# Altium project STM32F411.PrjPcb
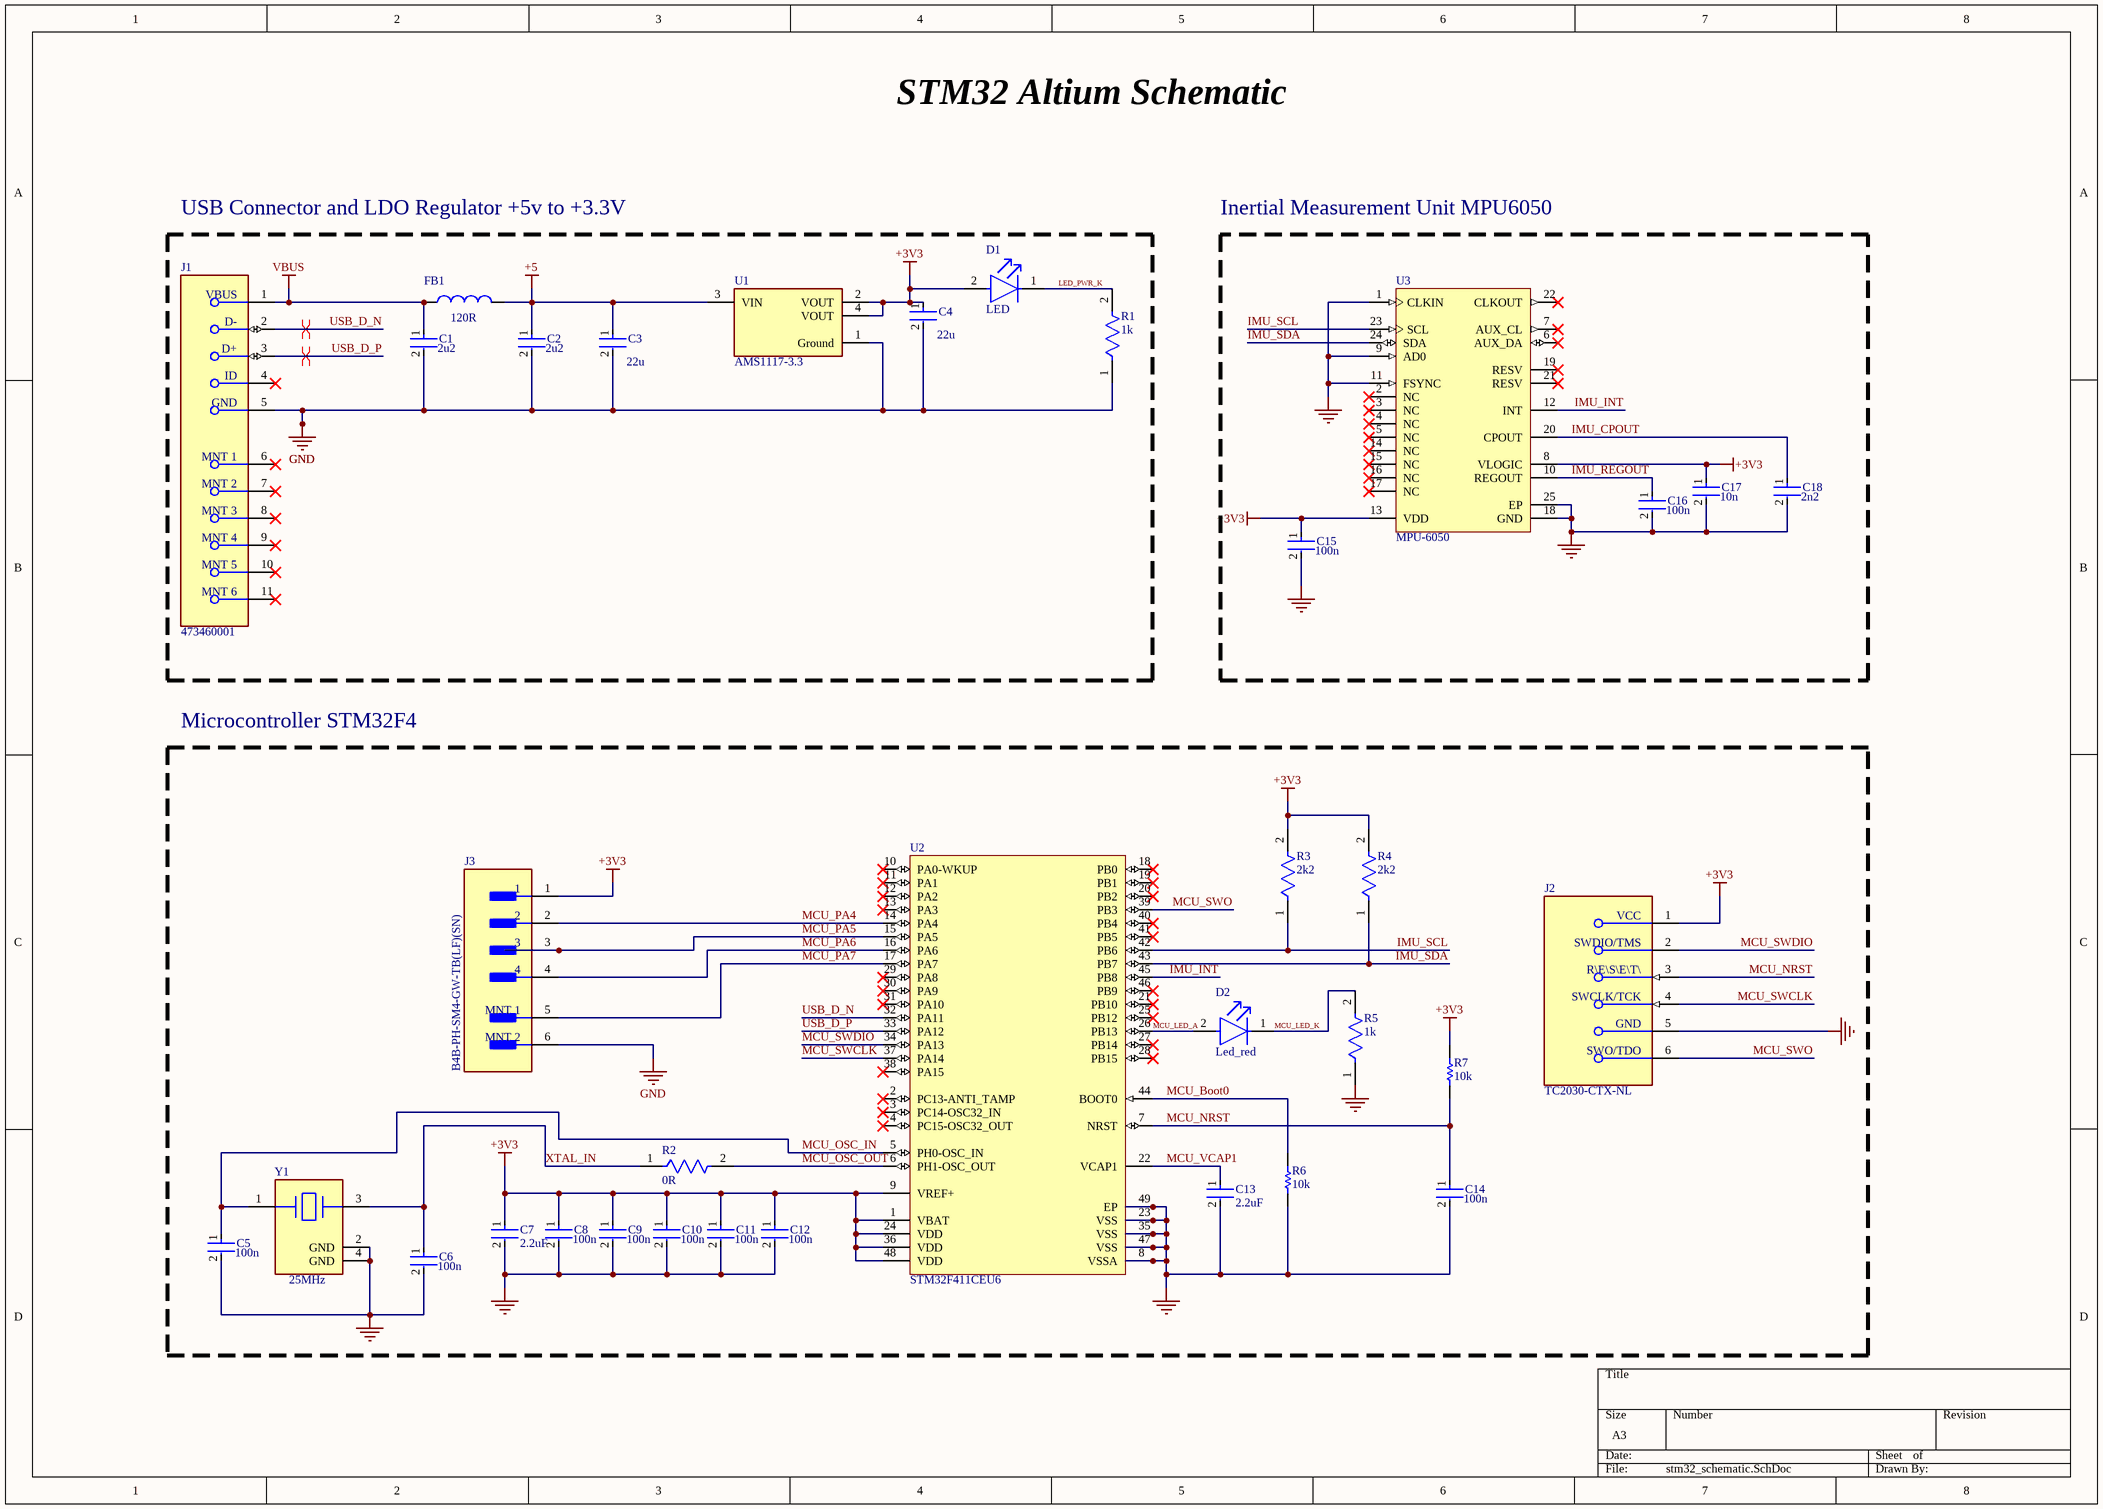
[diagram p0: stm32_schematic.SchDoc]
1 sheet, 35 parts. Net scope: global (net labels, ports and power ports of the same name join across sheets).
Board file: stm32PCB1.PcbDoc

## Sheet stm32_schematic.SchDoc
size A3; SheetNumber: 1; SheetTotal: 1

### Parts
C1  2u2  [FP-CC0402-MFG]
C2  2u2  [FP-CC0402-MFG]
C3  22u  [FP-GRM21B-0_15-IPC_A]
C4  22u  [FP-GRM21B-0_15-IPC_A]
C5  100n  [FP-CC0402-MFG]
C6  100n  [FP-CC0402-MFG]
C7  2.2uF  [FP-C0603C-CF-MFG]
C8  100n  [FP-CC0402-MFG]
C9  100n  [FP-CC0402-MFG]
C10  100n  [FP-CC0402-MFG]
C11  100n  [FP-CC0402-MFG]
C12  100n  [FP-CC0402-MFG]
C13  2.2uF  [FP-C0603C-CF-MFG]
C14  100n  [FP-CC0402-MFG]
C15  100n  [FP-CC0402-MFG]
C16  100n  [FP-CC0402-MFG]
C17  10n  [FP-CC0402-MFG]
C18  2n2  [FP-CC0402-MFG]
D1  LED  [FP-APHHS1005CGCK-MFG]
D2  Led_red  [FP-5988A10107F-MFG]
FB1  120R  [WE-CBA_0805_L2W1.2H0.9_HC]
J1  473460001  [FP-473460001-MFG]
J2  TC2030-CTX-NL  [FP-TC2030-CTX-NL-MFG]
J3  B4B-PH-SM4-GW-TB(LF)(SN)  [FP-B4B-PH-SM4-GW-TB_LF_S-MFG]
R1  1k  [FP-CR0402-IPC_C]
R2  0R  [FP-CR0402-IPC_A]
R3  2k2  [FP-CR0402-IPC_C]
R4  2k2  [FP-CR0402-IPC_C]
R5  1k  [FP-CR0402-IPC_C]
R6  10k  [RESC1005X37X20ML05T10]
R7  10k  [RESC1005X37X20ML05T10]
U1  AMS1117-3.3  [FP-AMS1117-IPC_C]
U2  STM32F411CEU6  [STM-UFQFPN48_L]
U3  MPU-6050  [IS-QFN-24_V]
Y1  25MHz  [FP-ABM11AIG-MFG]

### Blocks framed on the sheet
USB Connector and LDO Regulator +5v to +3.3V: C1-C4 D1 FB1 J1 R1 U1
Inertial Measurement Unit MPU6050: C15-C18 U3
Microcontroller STM32F4: C5-C14 D2 J2 J3 R2-R7 U2 Y1

### Nets
+3V3: C4.1 C7.1 C8.1 C9.1 C10.1 C11.1 C12.1 C15.1 C17.1 D1.2(A) J2.1(VCC) J3.1 R3.2 R4.2 R7.2 U1.2(VOUT) U1.4(VOUT) U2.1(VBAT) U2.9(VREF+) U2.24(VDD) U2.36(VDD) U2.48(VDD) U3.8(VLOGIC) U3.13(VDD)
+5: C2.1 C3.1 FB1.2 U1.3(VIN)
GND: C1.2 C2.2 C3.2 C4.2 C5.2 C6.2 C7.2 C8.2 C9.2 C10.2 C11.2 C12.2 C13.2 C14.2 C15.2 C16.2 C17.2 C18.2 J1.5(GND) J2.5(GND) J3.6(MNT_2) R1.1 R5.1 R6.1 U1.1(Ground) U2.8(VSSA) U2.23(VSS) U2.35(VSS) U2.47(VSS) U2.49(EP) U3.1(CLKIN) U3.9(AD0) U3.11(FSYNC) U3.18(GND) U3.25(EP) Y1.2(GND) Y1.4(GND)
VBUS: C1.1 FB1.1 J1.1(VBUS)
IMU_CPOUT: C18.1 U3.20(CPOUT)
IMU_INT: U2.45(PB8) U3.12(INT)
IMU_REGOUT: C16.1 U3.10(REGOUT)
IMU_SCL: R3.1 U2.42(PB6) U3.23(SCL)
IMU_SDA: R4.1 U2.43(PB7) U3.24(SDA)
LED_PWR_K: D1.1(C) R1.2
MCU_Boot0: R6.2 U2.44(BOOT0)
MCU_LED_A: D2.2(A) U2.26(PB13)
MCU_LED_K: D2.1(C) R5.2
MCU_NRST: C14.1 J2.3(~{RESET}) R7.1 U2.7(NRST)
MCU_OSC_IN: C5.1 U2.5(PH0-OSC_IN) Y1.1(1_Crystal)
MCU_OSC_OUT: R2.2 U2.6(PH1-OSC_OUT)
MCU_PA4: J3.2 U2.14(PA4)
MCU_PA5: J3.3 U2.15(PA5)
MCU_PA6: J3.4 U2.16(PA6)
MCU_PA7: J3.5(MNT_1) U2.17(PA7)
MCU_SWCLK: J2.4(SWCLK/TCK) U2.37(PA14)
MCU_SWDIO: J2.2(SWDIO/TMS) U2.34(PA13)
MCU_SWO: J2.6(SWO/TDO) U2.39(PB3)
MCU_VCAP1: C13.1 U2.22(VCAP1)
USB_D_N: J1.2(D-) U2.32(PA11)
USB_D_P: J1.3(D+) U2.33(PA12)
XTAL_IN: C6.1 R2.1 Y1.3(2_Crystal)

Not connected (* = marked no-connect by the designer): J1 4(ID)* 6(MNT_1)* 7(MNT_2)* 8(MNT_3)* 9(MNT_4)* 10(MNT_5)* 11(MNT_6)*; U2 2(PC13-ANTI_TAMP)* 3(PC14-OSC32_IN)* 4(PC15-OSC32_OUT)* 10(PA0-WKUP)* 11(PA1)* 12(PA2)* 13(PA3)* 18(PB0)* 19(PB1)* 20(PB2)* 21(PB10)* 25(PB12)* 27(PB14)* 28(PB15)* 29(PA8)* 30(PA9)* 31(PA10)* 38(PA15)* 40(PB4)* 41(PB5)* 46(PB9)*; U3 2(NC)* 3(NC)* 4(NC)* 5(NC)* 6(AUX_DA)* 7(AUX_CL)* 14(NC)* 15(NC)* 16(NC)* 17(NC)* 19(RESV)* 21(RESV)* 22(CLKOUT)*

### Layout directives
differential pair; differential pair class DIFF_USB: USB_D_N, USB_D_P

### Notes on the sheet
- STM32 Altium Schematic

### Library data of the parts
C1 C2 C5 C6 C8-C12 C14-C18 = CMP-03422-001191-1: CAP CER 1UF 16V X5R 0402; Manufacturer: YAGEO; Manufacturer Part Number: CC0402KRX5R7BB105; Automotive Grade: NA; Material: Ceramic; Tolerance: 0.1; Temperature Coefficient: 30ppm/°C; Octopart: https://octopart.com/cc0402krx5r7bb105-yageo-25629500; Digikey Description: CAP CER 1UF 16V X5R 0402; ComponentLink2URL: http://www.yageo.com/documents/recent/UPY-GP_NP0_16V-to-50V_16.pdf; Lead Free: Yes; Ipc Land Pattern Name: CAPC10050X50; Device Class L3: Ceramic Capacitors; Capacitance: 1 uF; Automotive: No; Device Class L2: Capacitors; Package: CC0402; Footprint Url: http://www.yageo.com/exep/pages/download/literatures/UPY-C_GEN_24.pdf; Temperature Range Low: -55°C; Value: 1 uF; Temperature Range High: +125°C; Height: 0.55mm; Category: Cap; ComponentLink2Description: Datasheet; Temperature Characteristic: X5R; Voltage Rating: 16 V; Mouser Description: 0402 1 uF 16 V ±10% Tolerance X5R Multilayer Ceramic Chip Capacitor; Temperature: -55°C to +125°C; Device Class L1: Passive Components; RoHS: TRUE
C3 C4 = CMP-06035-033280-1: Chip Multilayer Ceramic Capacitors for General Purpose, 0805, 4.7uF, X6S, 22%, 20%, 35V; Length: 2mm; Dielectric: X6S; Width: 1.25mm; Capacitance: 4.7uF; Case/Package: 0805; Tolerance: 20%; Voltage Rating (DC): 35V; Thickness: 1.25mm
C7 C13 = CMP-03020-001925-2: C0603 0.10 μF X7R 30ppm/°C 5.00% 16 V; Manufacturer: KEMET; Manufacturer Part Number: C0603C104J4RAC; Automotive Grade: Grade 1; Capacitance: 0.10 μF; Voltage Rating: 16 V; Value: 0.10 μF; Material: Ceramic; Tolerance: 0.05; Category: Cap; Temperature Range Low: -55°C; Package: C0603C-CF; Temperature: -55°C to +125°C; RoHS: TRUE; Device Class L3: Ceramic Capacitors; Automotive: Yes; Temperature Range High: +125°C; Device Class L1: Passive Components; Lead Free: Yes; Device Class L2: Capacitors; ComponentLink2Description: Datasheet; Temperature Coefficient: 30ppm/°C; ComponentLink2URL: https://api.kemet.com/component-edge/download/datasheet/C0603C100J5GACAUTO.pdf; Height: 0.87mm; Octopart: https://octopart.com/c0603c104j4rac-kemet-1309211; Temperature Characteristic: X7R; Mouser Description: Cap Ceramic 0.1uF 16V X7R 5% Pad SMD 0603 125C Bulk
D1 = CMP-44529-000044-1: LED GREEN CLEAR CHIP SMD; Viewing Angle: 120°; Dominant Wavelength: 570nm; Test Current: 20mA; Luminous Intensity: 50mcd; Forward Voltage: 2.1V; Number of LEDs: 1; Lens Color: Clear; Packaging: Tape and Reel; Max Operating Temperature: 85°C; Illumination Color: Green; Length: 1mm; Mount: Surface Mount; Lens Style: Clear; Color: Green; Number of Pins: 2; Wavelength: 570nm; Case/Package: 0402; Width: 0.5mm; Package Quantity: 2000; Case Code (Metric): 1005; Height: 0.6mm; Lead Free: Lead Free; Case Code (Imperial): 0402; Forward Current: 20mA; Min Operating Temperature: -40°C
D2 = CMP-00106-100993512-1: 5988A10107F LED Uni-Color Red 2-Pin Chip 0402(1006Metric) T/R; Forward Voltage: 1.6V; Forward Current: 5mA; Power Dissipation: 46mW; Reverse Voltage: 5V; Luminous Intensity: 65mcd; Viewing Angle: 140°; Wavelength: 635nm; Max Operating Temperature: 85°C; Case/Package: 0402; Color: Red; Height: 533.4µm; NexarPartId: 100993512; RoHS: Compliant; Schedule B: 8541402000, 8541402000; Min Operating Temperature: -40°C
FB1 = CMP-03913-112295557-2: Ferrite Bead, 700 Ohm, 1.5A, 0805 Rohs Compliant: Yes; DC Resistance (DCR): 100mΩ; RoHS: Compliant; Max Operating Temperature: 125°C; Ambient Temperature Range High: 85°C; Length: 2mm; Min Operating Temperature: -55°C; Ambient Temperature Range Low: -55°C; Height: 900µm; Width: 1.2mm; Current Rating: 1.5A
J1 = CMP-2000-05246-2: CONN RCPT USB2.0 MICRO B SMD R/A; Manufacturer: Molex; Conn Orientation: Right Angle; Is Female: yes; Shielding: true; Pitch: 0.65mm; Number Of Contacts: 5; Voltage Rating: 30V; Current Rating: 1.8A; Device Class L2: USB Connectors; Digikey Description: CONN RCPT USB2.0 MICRO B SMD R/A; Height: 2.945mm; RoHS: TRUE; ComponentLink2Description: Datasheet; Octopart: https://octopart.com/47346-0001-molex-7164928; Automotive: No; Package: 0; Category: Conn; Device Class L1: Connectors; Usb Standard: USB 2.0; Temperature: -30°C to +85°C; Temperature Range Low: -30°C; Footprint Url: https://www.molex.com/pdm_docs/sd/473460001_sd.pdf; ComponentLink2URL: https://www.molex.com/webdocs/datasheets/pdf/en-us/0473460001_IO_CONNECTORS.pdf; Lead Free: Yes; Manufacturer Part Number: 473460001; Contact Material: Gold,Nickel; Temperature Range High: +85°C; Device Class L3: unset
J2 = CMP-205963-000001-1: 6-Pin “No legs” TC2030 Plug-of-Nails™ Cable for use with ARM Cortex processors
J3 = CMP-17439-000485-1: Connector header SMT, 4 Contacts, 2A, 100V, top entry male pins
R1 R3-R5 = CMP-2002-05510-2: Thick Film Chip Resistors 0402 6.8Ω 0.0625W 5%; Max Power Dissipation: 63mW; Power Rating: 62.5mW; Temperature Coefficient: 500ppm/°C; Voltage Rating: 50V; Resistance: 6.8R; Packaging: Tape and Reel; Radiation Hardening: No; Mount: Surface Mount; Width: 0.5mm; Min Operating Temperature: -55°C; Height: 0.35mm; Termination: SMD/SMT; Depth: 0.5mm; Case Code (Metric): 1005; Case Code (Imperial): 0402; Case/Package: 0402; Weight: 2.3E-05oz; Military Standard: Not; Contact Plating: Tin; Length: 1mm; Tolerance: 5%; Composition: Thick Film; Thickness: 356um; Max Operating Temperature: 125°C
R2 = CMP-1011-00610-3: Thick Film Chip Resistors 0402 7.68kΩ 0.0625W 1% 100ppm/°C; Power Rating: 62.5mW; Resistance: 7.68kR; Voltage Rating: 50V; Radiation Hardening: No; Depth: 0.5mm; Thickness: 356um; Max Operating Temperature: 125°C; Military Standard: Not; Width: 0.5mm; Contact Plating: Tin; Termination: SMD/SMT; Composition: Thick Film; Case/Package: 0402; Weight: 2.3E-05oz; Temperature Coefficient: 100ppm/°C; Case Code (Metric): 1005; Length: 1mm; Packaging: Tape and Reel; Case Code (Imperial): 0402; Height: 0.35mm; Min Operating Temperature: -55°C; Tolerance: 1%; Mount: Surface Mount
R6 R7 = CMP-2002-02538-1: Part Number: MCS04020F2262BE100; Manufacturer: Vishay BCcomponents
U1 = CMP-209535-000001-1: LDO Voltage Regulators 1A, 3.3V; Manufacturer: Advanced Monolithic Systems; Dropout Voltage: 1.1V; Output Type: Fixed; Nominal Supply Current: 5mA; Max Power Dissipation: 1.2W; Max Supply Voltage: 15V; Number Of Outputs: 1; Standoff Height: 0.64mm; Max Junction Temp: +125°C; Height: 1.8mm; Package: AMS1117; Device Class L2: Power Management ICs; ComponentLink2Description: Datasheet; ComponentLink2URL: http://www.advanced-monolithic.com/pdf/ds1117.pdf; Category: IC; RoHS: TRUE; Automotive: No; Device Class L1: Integrated Circuits (ICs); Output Current: 1A; Device Class L3: Voltage Regulators - Linear; Temperature: -40°C to +125°C; Output Voltage: 3.3V; Manufacturer Part Number: AMS1117-3.3; Temperature Range Low: -40°C; Octopart: https://octopart.com/ams1117-3.3-advanced+monolithic+systems-25899300; Lead Free: Yes; Ipc Land Pattern Name: SOT229P700X180-4; Temperature Range High: +125°C
U2 = CMP-0243-00165-1: ARM Cortex-M4 32-bit MCU+FPU, 512 KB Flash, 128 KB RAM, 36 I/Os, 48-Pin UFQFPN, -40 to 85 degC, Tray; Operating Frequency(F) (Processor speed) (MHz): 100; FLASH Size (Prog) (kB): 512; Internal RAM Size (kB): 128; I/Os (High Current): 36; Supply Voltage(Vcc) min (V): 1.7; Package Reference: 48-Pin Ultra Thin Fine Pitch Quad Flat No-Lead, 7 x 7 x 0.6 mm Body, 0.5 mm Pitch, Exposed Pad; ComponentLink1Description: Manufacturer URL; ComponentLink1URL: http://www.st.com/; Packing: Tray; Package Description: UFQFPN48; Core: ARM Cortex-M4; ComponentLink2Description: Datasheet; ComponentLink2URL: http://www.st.com/st-web-ui/static/active/en/resource/technical/document/datasheet/DM00115249.pdf; DatasheetVersion: Rev. 6; Mounting Technology: Surface Mount
U3 = CMP-1753-00002-2: 3-Axis Gyroscope, Accelerometer and a Digital Motion Processor(TM) (DMP), 2.375 to 3.46 V, -40 to 85 degC, 24-Pin QFN, RoHS, Tape and Reel; Manufacturer: InvenSense; Featured Product: MPU-60506-Axis,IntegratedI²CSolution; Other Names: 1428-1007-2 / MPU6050; Sensor Type: MotionTracking; Online Catalog: MPU-6000™Series; Unit PriceUSD: Digital; Datasheet Version: Rev. 3.3, 05/2012; Category: Sensors,Transducers; Datasheet URL: http://datasheet.octopart.com/MPU-6050-InvenSense-datasheet-14421344.pdf; Family: Multifunction; Standard Package: 5,000; Manufacturer URL: http://www.invensense.com/; Output Type: Digital; Dynamic Catalog: MPU-6000™Series
Y1 = CMP-27762-012485-1: Crystal 25MHz ±30ppm 10pF SMD-4 2.5mm x 2mm Automotive; ESR (Equivalent Series Resistance): 100R; Frequency Stability: 50ppm; Case/Package: SMD/SMT; RoHS Compliant: Yes; Width: 0.079inch; Ratings: AEC-Q200; Height: 0.024inch; Max Operating Temperature: 105°C; Frequency Tolerance: 30ppm; Packaging: Tape and Reel; Mount: Surface Mount; Length: 0.098inch; Load Capacitance: 10pF; Min Operating Temperature: -40°C; Frequency: 25MHz